# EasyEDA schematic SCH_Mini-mc-server.json
TITLE: Sheet_1; REV: 1.0; Date: 2026-09-21; Sheet: 1/1; Drawn By: zorp_; Company: Your Company
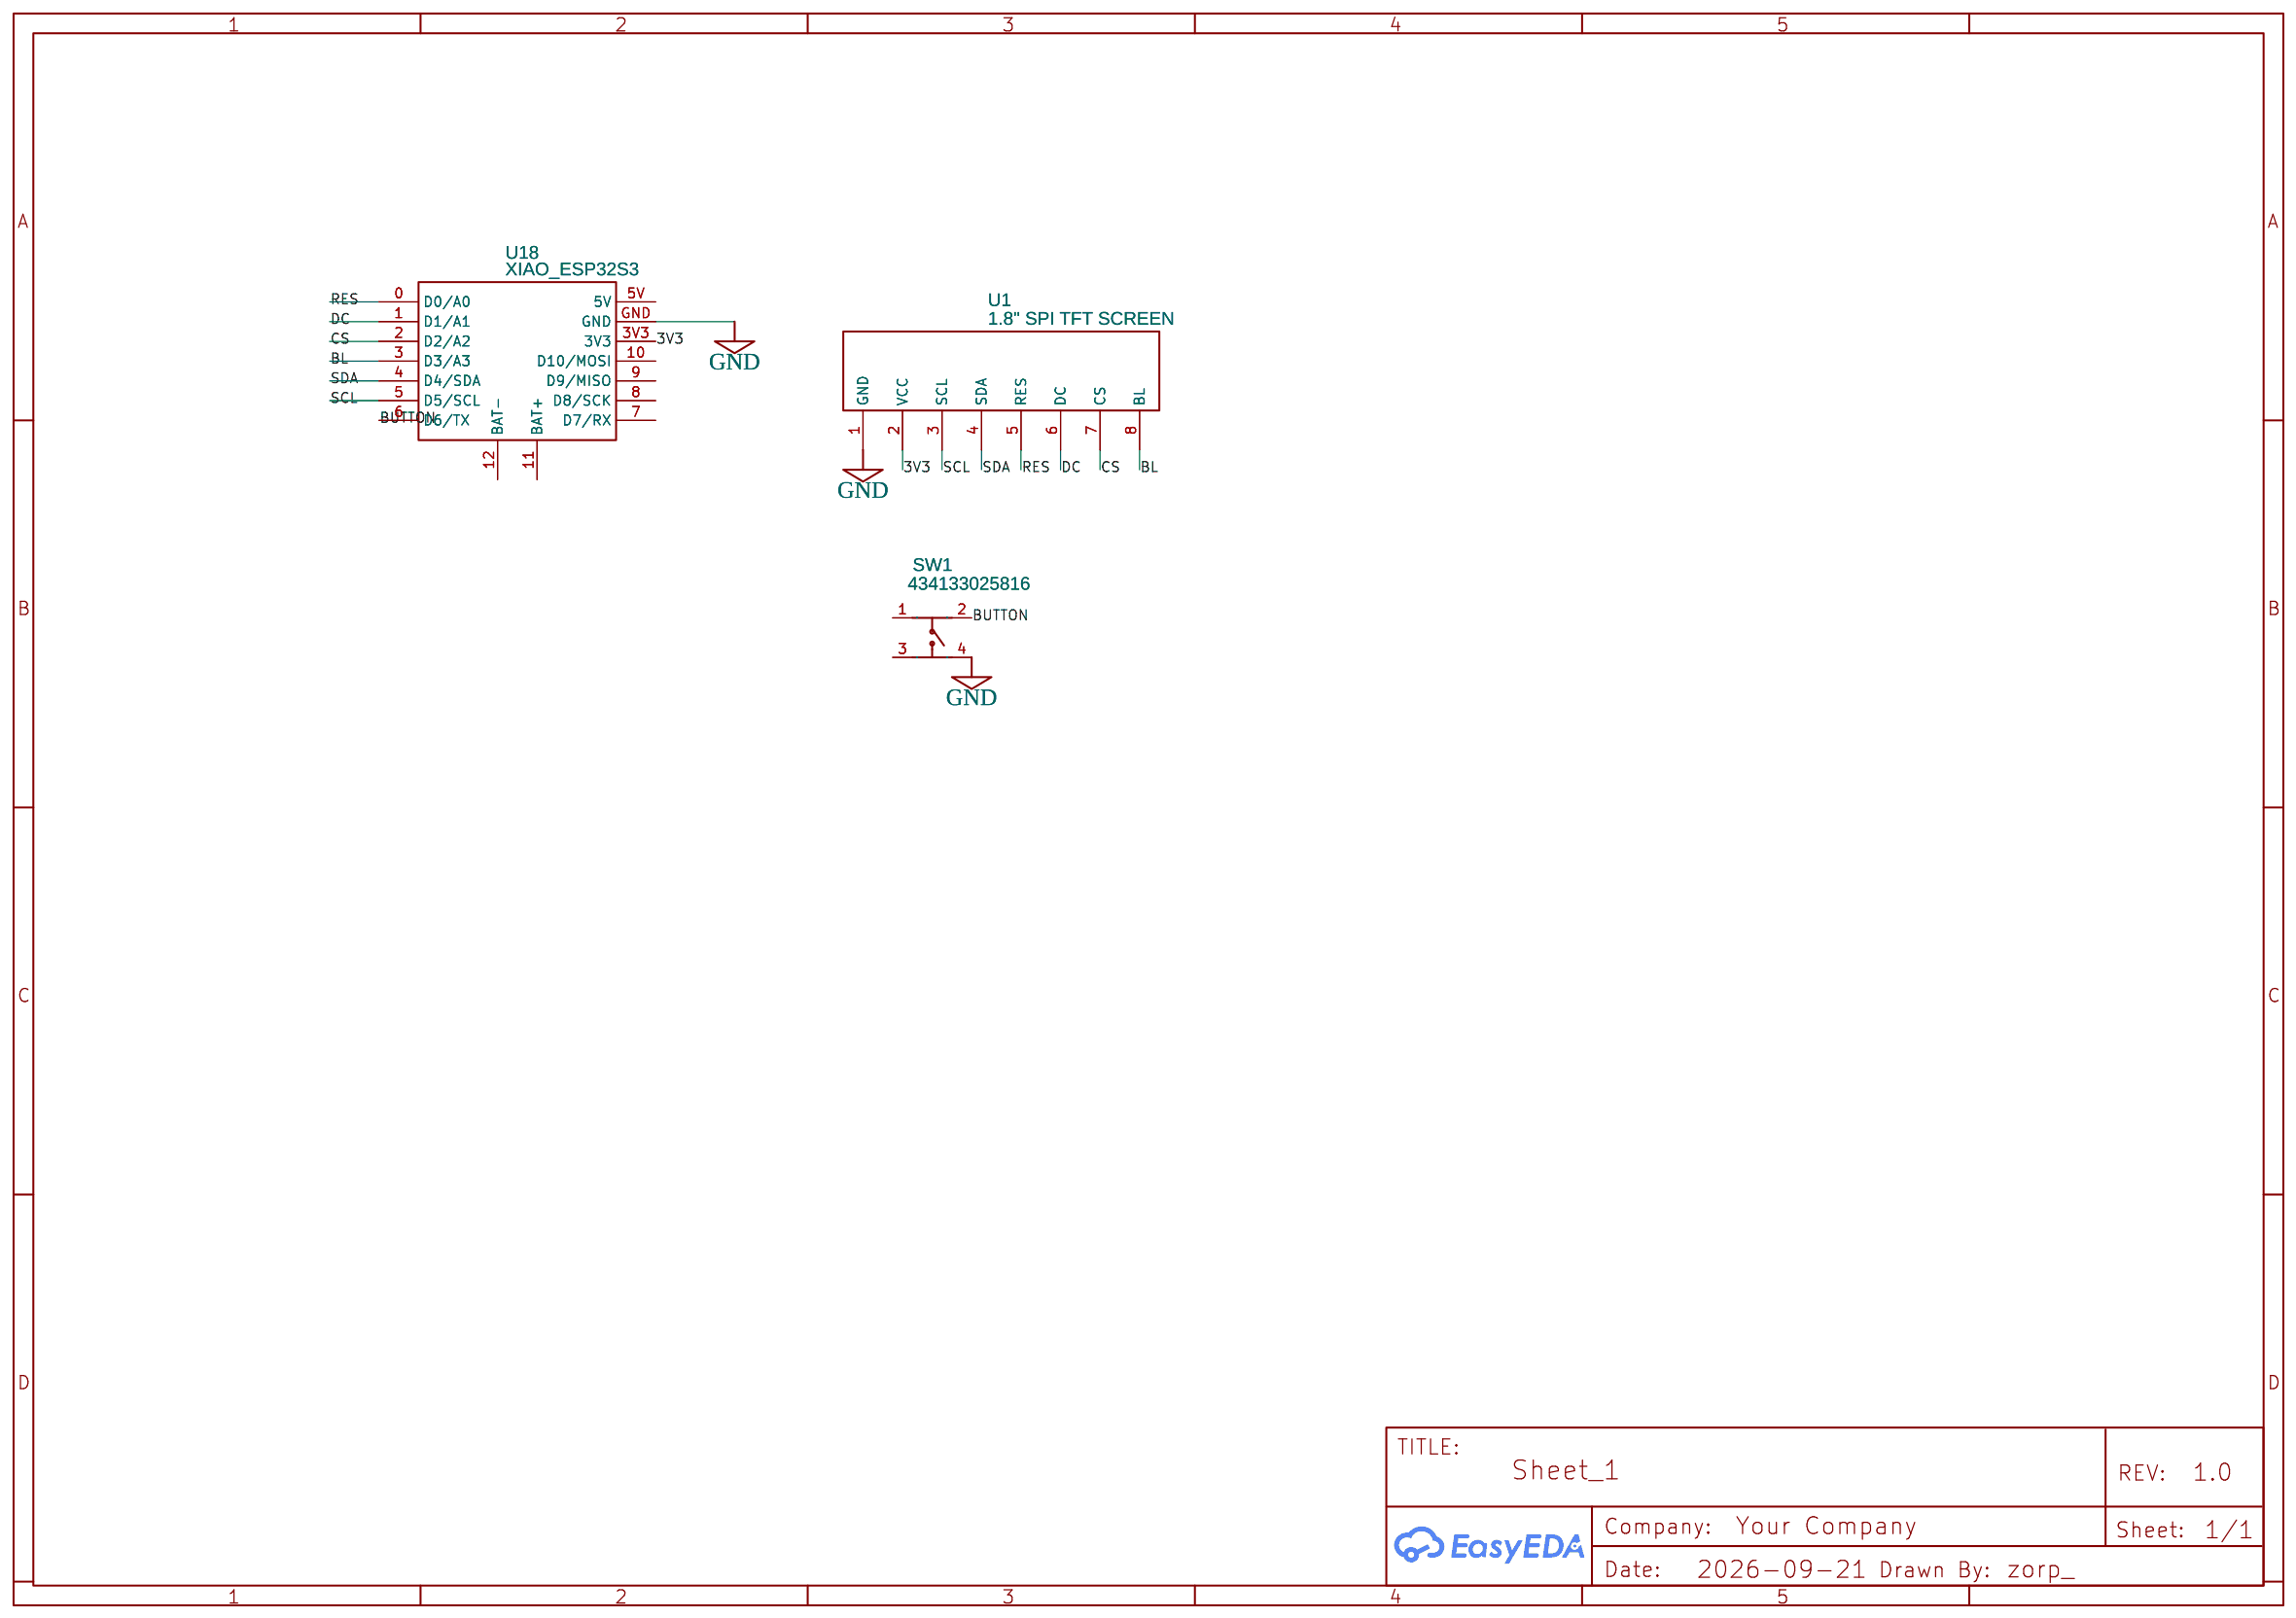
[diagram p0: schematic sheet]

## Parts
SW1  434133025816  [SW-SMD_4P-L4.2-W3.2-P2.15-LS4.6]
U1  1.8" SPI TFT SCREEN  [1.8" SPI TFT SCREEN]
U18  XIAO_ESP32S3  [XIAO-ESP32-S3]

## Library data of the parts
SW1 = 434133025816: Supplier: LCSC; Supplier Part: C5504987; Manufacturer: Wurth(伍尔特); JLCPCB Part Class: Extended Part; Contributor: lcsc
U1 = 1.8" SPI TFT SCREEN: Contributor: hiddevandijk
U18 = XIAO_ESP32S3 COPY: Manufacturer: SeeedStudio; Manufacturer Part: XIAO ESP32S3; Supplier Part: 1597-113991054-ND; Supplier: Digi-Key; link: https://www.seeedstudio.com/XIAO-ESP32S3-p-5627.html; Contributor: customyota

## Nets
3V3: U1.2(VCC) U18.3V3
GND: SW1.4 U1.1(GND) U18.GND
BL: U1.8(BL) U18.3(D3/A3)
BUTTON: SW1.2 U18.6(D6/TX)
CS: U1.7(CS) U18.2(D2/A2)
DC: U1.6(DC) U18.1(D1/A1)
RES: U1.5(RES) U18.0(D0/A0)
SCL: U1.3(SCL) U18.5(D5/SCL)
SDA: U1.4(SDA) U18.4(D4/SDA)

Not connected (* = marked no-connect by the designer): SW1 1 3; U18 5V 7(D7/RX) 8(D8/SCK) 9(D9/MISO) 10(D10/MOSI) 11(BAT+) 12(BAT-)
